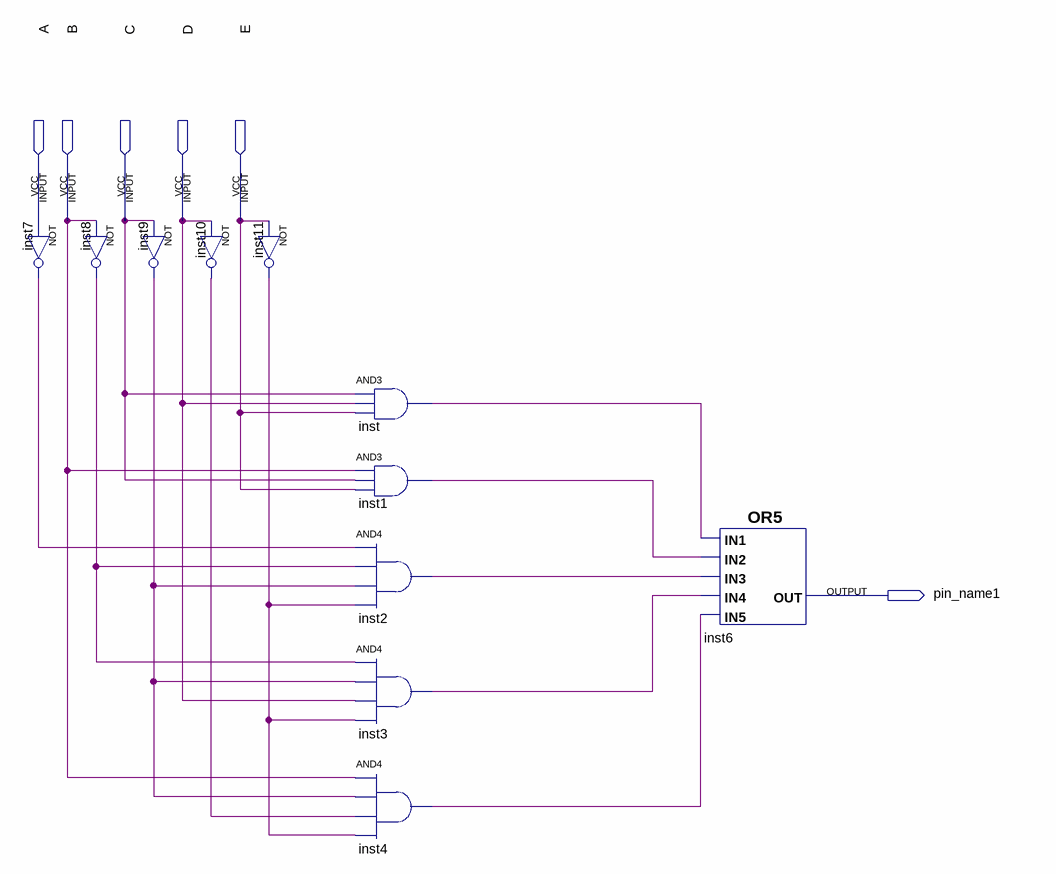
[diagram p0: schematic sheet]
// Quartus schematic questao1_D.bdf as structural Verilog: 11 symbols, 6 pins
module questao1_D (
  input  A,
  input  B,
  input  C,
  input  D,
  input  E,
  output pin_name1
);

  wire inst1_out, inst2_out, inst3_out, inst4_out, inst7_out, inst8_out, inst9_out, inst10_out, inst11_out,
       inst_out;

  not inst7 (inst7_out, A);
  not inst8 (inst8_out, B);
  not inst9 (inst9_out, C);
  not inst10 (inst10_out, D);
  not inst11 (inst11_out, E);
  and inst (inst_out, C, D, E);
  and inst1 (inst1_out, B, C, E);
  and inst2 (inst2_out, inst7_out, inst8_out, inst9_out, inst11_out);
  and inst3 (inst3_out, inst8_out, inst9_out, D, inst11_out);
  and inst4 (inst4_out, B, inst9_out, inst10_out, inst11_out);
  or inst6 (pin_name1, inst_out, inst1_out, inst2_out, inst3_out, inst4_out);
endmodule
